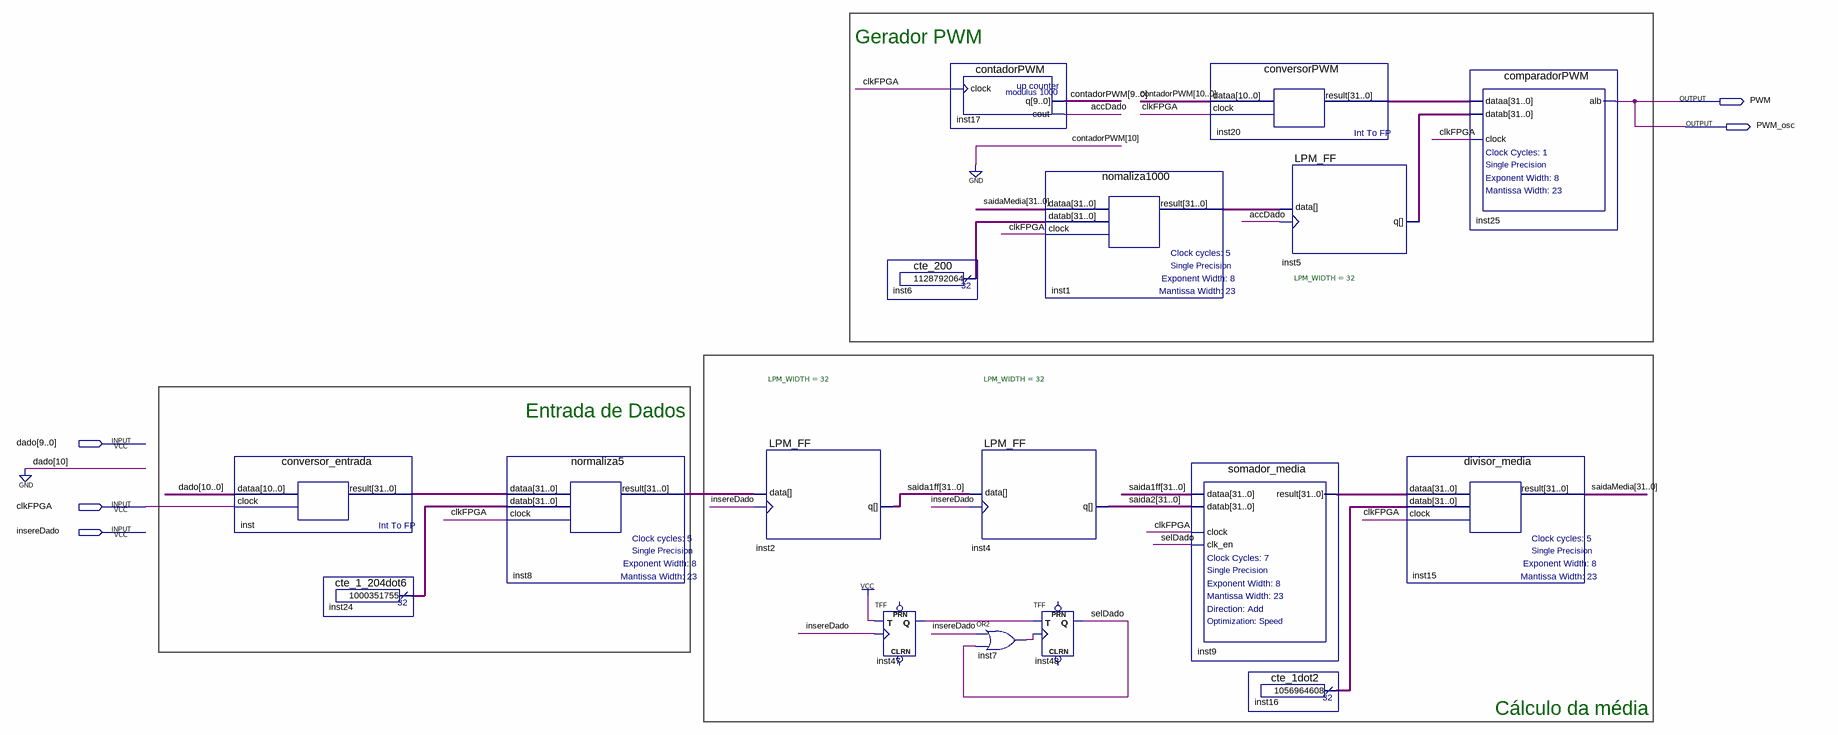
[diagram p0: schematic sheet]
// Quartus schematic media_movel.bdf as structural Verilog: 17 symbols, 5 pins
module media_movel (
  input  [9:0] dado,
  input  clkFPGA,
  input  insereDado,
  output PWM,
  output PWM_osc
);

  wire accDado, inst7_out, inst47_q, selDado;
  wire [9:0] contadorPWM;
  wire [31:0] inst1_result, inst5_q, inst6_result, inst8_result, inst9_result, inst16_result, inst20_result,
       inst24_result, inst_result, saida1ff, saida2, saidaMedia;

  conversor_entrada inst (.dataa({1'b0, dado}), .clock(clkFPGA), .result(inst_result));
  cte_1_204dot6 inst24 (.result(inst24_result));
  normaliza5 inst8 (.dataa(inst_result), .datab(inst24_result), .clock(clkFPGA), .result(inst8_result));
  LPM_FF #(.LPM_WIDTH(32)) inst2 (.clock(insereDado), .data(inst8_result), .q(saida1ff));
  cte_200 inst6 (.result(inst6_result));
  TFF inst47 (.T(1'b1), .CLK(insereDado), .Q(inst47_q));  // open: PRN, CLRN
  contadorPWM inst17 (.clock(clkFPGA), .cout(accDado), .q(contadorPWM));
  LPM_FF #(.LPM_WIDTH(32)) inst4 (.clock(insereDado), .data(saida1ff), .q(saida2));
  or inst7 (inst7_out, insereDado, selDado);
  nomaliza1000 inst1 (.dataa(saidaMedia), .datab(inst6_result), .clock(clkFPGA), .result(inst1_result));
  TFF inst48 (.T(inst47_q), .CLK(inst7_out), .Q(selDado));  // open: PRN, CLRN
  conversorPWM inst20 (.dataa({1'b0, contadorPWM}), .clock(clkFPGA), .result(inst20_result));
  somador_media inst9 (.dataa(saida1ff), .datab(saida2), .clock(clkFPGA), .clk_en(selDado), .result(inst9_result));
  cte_1dot2 inst16 (.result(inst16_result));
  LPM_FF #(.LPM_WIDTH(32)) inst5 (.clock(accDado), .data(inst1_result), .q(inst5_q));
  divisor_media inst15 (.dataa(inst9_result), .datab(inst16_result), .clock(clkFPGA), .result(saidaMedia));
  comparadorPWM inst25 (.dataa(inst20_result), .datab(inst5_q), .clock(clkFPGA), .alb(PWM));

  assign PWM_osc = PWM;

  // Notes on the sheet:
  //   Gerador PWM
  //   Entrada de Dados
  //   Cálculo da média
endmodule
